# Altium project PCB_Project.PrjPcb
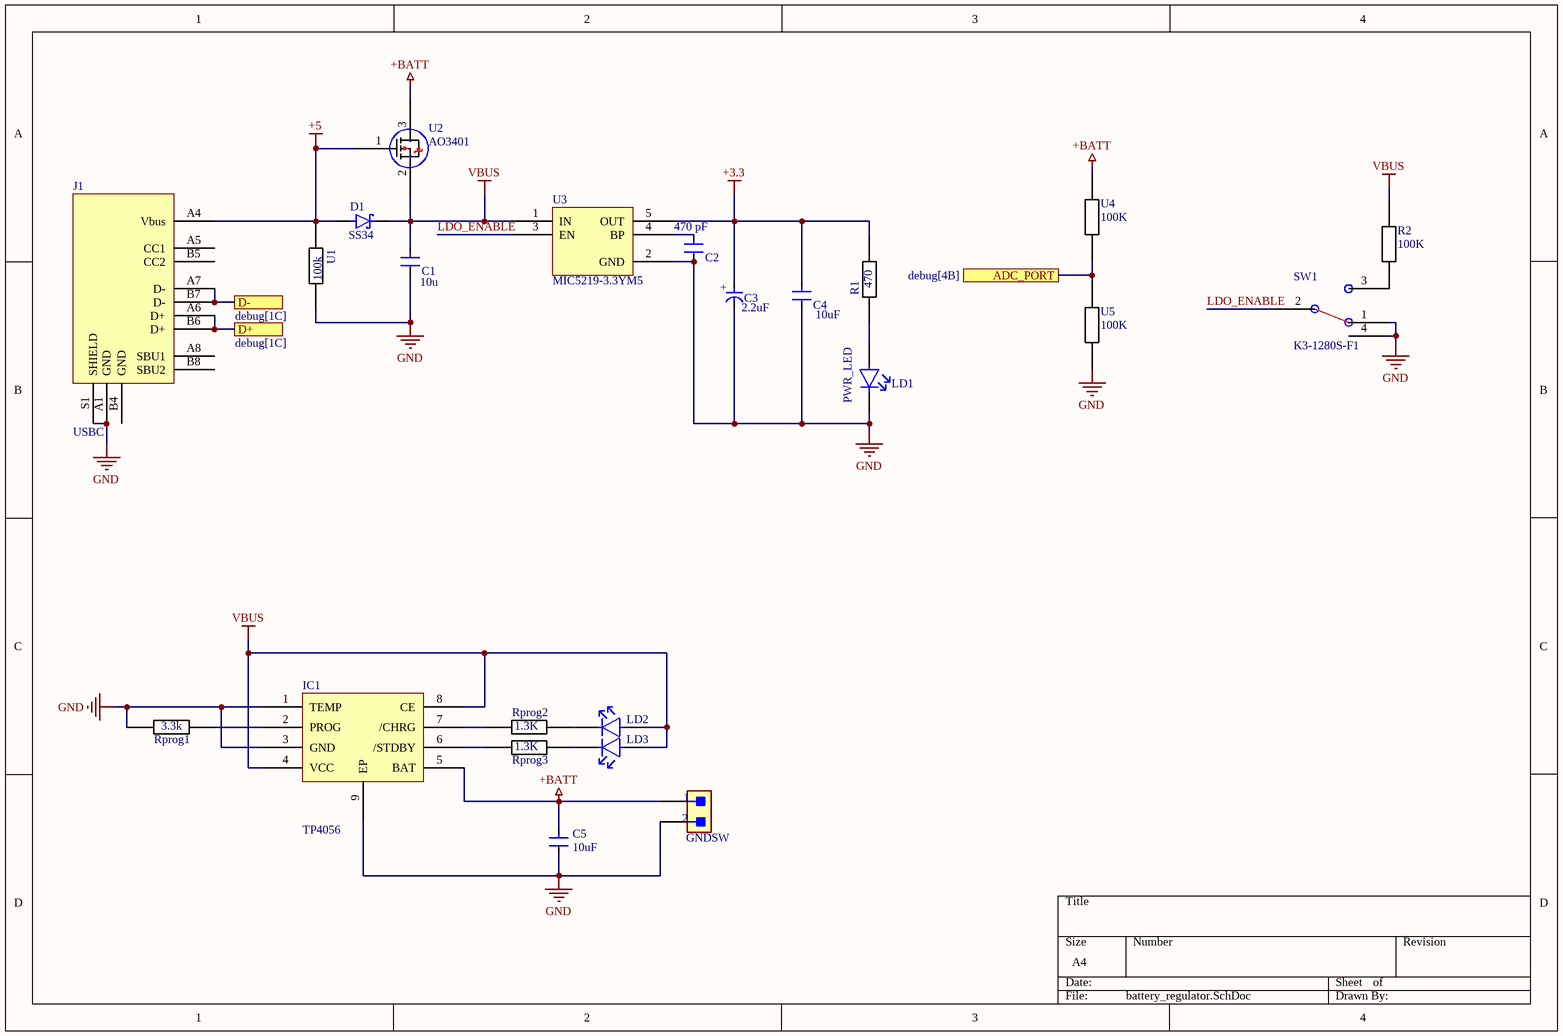
[diagram p0: battery_regulator.SchDoc]
3 sheets, 74 parts. Net scope: flat (ports and power ports of the same name join across sheets).
Board file: PCB_drone.PcbDoc
Sheets:
  battery_regulator.SchDoc
  debug.SchDoc
  motor_drivers.SchDoc

## Sheet battery_regulator.SchDoc
size A4; SheetNumber: 1; SheetTotal: 3

### Parts
C1  10u  [res0805ph]
C2  470 pF  [res0805ph]
C3  2.2uF  [res0805ph]
C4  10uF  [res0805ph]
C5  10uF  [res0805ph]
D1  SS34  [DIOM7959X265N]
GNDSW  TMM-102-02-L-S  [JST_B2B-XH-A_(LF)(SN)]  (value not drawn)
IC1  TP4056  [SOP127P600X175-9N]
J1  USBC  [SHENZHEN-CHUANGQIN-TECHNOLOGY_CQ-USB-C16PSMT01]
LD1  PWR_LED  [res0805ph]
LD2  APT1608ZGCK  [res0805ph]  (value not drawn)
LD3  APT1608ZGCK  [res0805ph]  (value not drawn)
R1  470  [res0805ph]
R2  100K  [res0805ph]
Rprog1  3.3k  [res0805ph]
Rprog2  1.3K  [res0805ph]
Rprog3  1.3K  [res0805ph]
SW1  K3-1280S-F1  [SW-SMD_K3-1280S-K1]
U1  100k  [res0805ph]
U2  AO3401  [SOT23-3]
U3  MIC5219-3.3YM5  [FP-SOT23-5LD-PL-1-IPC_C]
U4  100K  [res0805ph]
U5  100K  [res0805ph]

### Ports
ADC_PORT (see debug[4B]), D+ (see debug[1C]), D- (see debug[1C])

### Nets
+3.3: C3.2(A) C4.1 R1.2 U3.5(OUT)
+5: D1.A J1.A4(Vbus) U1.2 U2.1
+BATT: C5.1 GNDSW.1 IC1.5(BAT) U2.3 U4.1
GND: C1.2 C2.2 C3.1(C) C4.2 C5.2 GNDSW.2 IC1.1(TEMP) IC1.3(GND) IC1.9(EP) J1.A1(GND) J1.S1(SHIELD) LD1.1(C) Rprog1.2 SW1.1 SW1.4 U1.1 U3.2(GND) U5.2
VBUS: C1.1 D1.C(K) IC1.4(VCC) IC1.8(CE) LD2.2(A) LD3.2(A) R2.1 U2.2 U3.1(IN)
LDO_ENABLE: SW1.2 U3.3(EN)
NetC2_1: C2.1 U3.4(BP)
NetIC1_2: IC1.2(PROG) Rprog1.1
NetIC1_6: IC1.6(/STDBY) Rprog3.2
NetIC1_7: IC1.7(/CHRG) Rprog2.2
NetJ1_A6: J1.A6(D+) J1.B6(D+) ; port D+
NetJ1_A7: J1.A7(D-) J1.B7(D-) ; port D-
NetLD1_2: LD1.2(A) R1.1
NetLD2_1: LD2.1(C) Rprog2.1
NetLD3_1: LD3.1(C) Rprog3.1
NetR2_2: R2.2 SW1.3
NetU4_2: U4.2 U5.1 ; port ADC_PORT

Not connected (* = marked no-connect by the designer): J1 A5(CC1) A8(SBU1) B4(GND) B5(CC2) B8(SBU2)

### Notes on the sheet
- (in symbol Elco+tantaal_1) +

### Library data of the parts
C1 C2 = CER Capacitor_1: Voltage Rating (DC): 35V; Tolerance: 20%; Capacitance: 10uF; Dielectric: X6S; Width: 0.049inch; Thickness: 0.057inch; Voltage Rating: 35V; Min Operating Temperature: -55°C; Case Code (Imperial): 0805; Mount: Surface Mount; Packaging: Tape and Reel; Case/Package: 0805; Max Operating Temperature: 105°C; Length: 0.079inch; Case Code (Metric): 2012
C3 = Elco+tantaal_1: 47uF 6.3V  ±20% 1.1Ω 2917  SMD Tantalum Capacitor; ESR (Equivalent Series Resistance): 1.1R; Dissipation Factor: 6%; Polarity: Polar; Voltage Rating: 6.3V; Width: 0.169inch; Tolerance: 20%; Series: TAJ; Case/Package: 2917; Max Operating Temperature: 125°C; Depth: 4.3mm; Voltage Rating (DC): 6.3V; Package Quantity: 500; Lead Free: Lead Free; Mount: Surface Mount; Length: 0.287inch; Min Operating Temperature: -55°C; Features: General Purpose; Packaging: Tape and Reel; Capacitance: 47uF; Height - Seated (Max): 0.122inch; RoHS Compliant: Yes
C4 C5 = CER Capacitor_1: Voltage Rating (DC): 35V; Tolerance: 20%; Dielectric: X6S; Width: 0.049inch; Thickness: 0.057inch; Voltage Rating: 35V; Min Operating Temperature: -55°C; Case Code (Imperial): 0805; Mount: Surface Mount; Packaging: Tape and Reel; Capacitance: 10uF; Case/Package: 0805; Max Operating Temperature: 105°C; Length: 0.079inch; Case Code (Metric): 2012
GNDSW = Connector 1x2_1: CONN HEADER VERT 2POS 2MM; Max Voltage Rating (AC): 500V; Number of Contacts: 2; Max Current Rating: 3.9A; Gender: Male; Number of Rows: 1; REACH SVHC: No SVHC; Contact Material: Bronze; Length: 4mm; Depth: 1.97mm; Pitch: 2mm; Radiation Hardening: No; Contact Plating: Gold; Min Operating Temperature: -55°C; RoHS Compliant: Yes; Packaging: Bulk; Orientation: Straight; Housing Material: Polymer; Housing Color: Black; Max Operating Temperature: 125°C; Termination: Solder; Lead Free: Lead Free
LD1-LD3 = LED_1: LED GREEN CLEAR CHIP SMD; Forward Voltage: 3.3V; Dominant Wavelength: 525nm; Forward Current: 20mA; Lens Color: Colorless; Viewing Angle: 120°; Luminous Intensity: 350mcd; Lens Transparency: Clear; Color: Green; Max Operating Temperature: 85°C; Case/Package: 0603; Mount: Surface Mount; Min Operating Temperature: -40°C; Case Code (Metric): 1608; Test Current: 20mA; Packaging: Tape and Reel; Width: 0.8mm; Package Quantity: 1; Height: 0.75mm; Length: 1.6mm; Illumination Color: Green; Lead Free: Lead Free; Case Code (Imperial): 0603
R1 R2 Rprog1-Rprog3 U1 U4 U5 = Weerstand_1: RES SMD 5.9K OHM 1% 1/4W 1206; Manufacturer: Yageo; Manufacturer Part Number: AC1206FR-075K9L; Resistance: 5.9KΩ; Power Rating: 0.25W; Voltage Rating: 200V; Automotive Grade: Grade 0; Value: 5.9KΩ; Tolerance: 0.01; Series: AC; Mouser Description: Thick Film Resistors - SMD 1/4W 5.9ohm 1% AEC-Q200; Lead Free: Yes; Octopart: https://octopart.com/ac1206fr-075k9l-yageo-30511161; Automotive: Yes; Temperature Range High: +155°C; ComponentLink2Description: Datasheet; Ipc Land Pattern Name: RESC310160X55; Temperature Range Low: -55°C; Digikey Description: RES SMD 5.9K OHM 1% 1/4W 1206; Device Class L3: Chip SMD Resistors; Device Class L2: Resistors; Category: Res; RoHS: TRUE; Height: 0.65mm; Package: AC1206; Temperature: -55°C to +155°C; ComponentLink2URL: http://www.yageo.com/NewPortal/yageodocoutput?fileName=/pdf/R-Chip/PYu-AC_51_RoHS_L_6.pdf; Device Class L1: Passive Components; Footprint Url: http://www.yageo.com/exep/pages/download/literatures/PYu-R_Mount_10.pdf; Composition: Thick Film
SW1 = Switch
U2 = Transistor

## Sheet debug.SchDoc
size A4; SheetNumber: 2; SheetTotal: 3
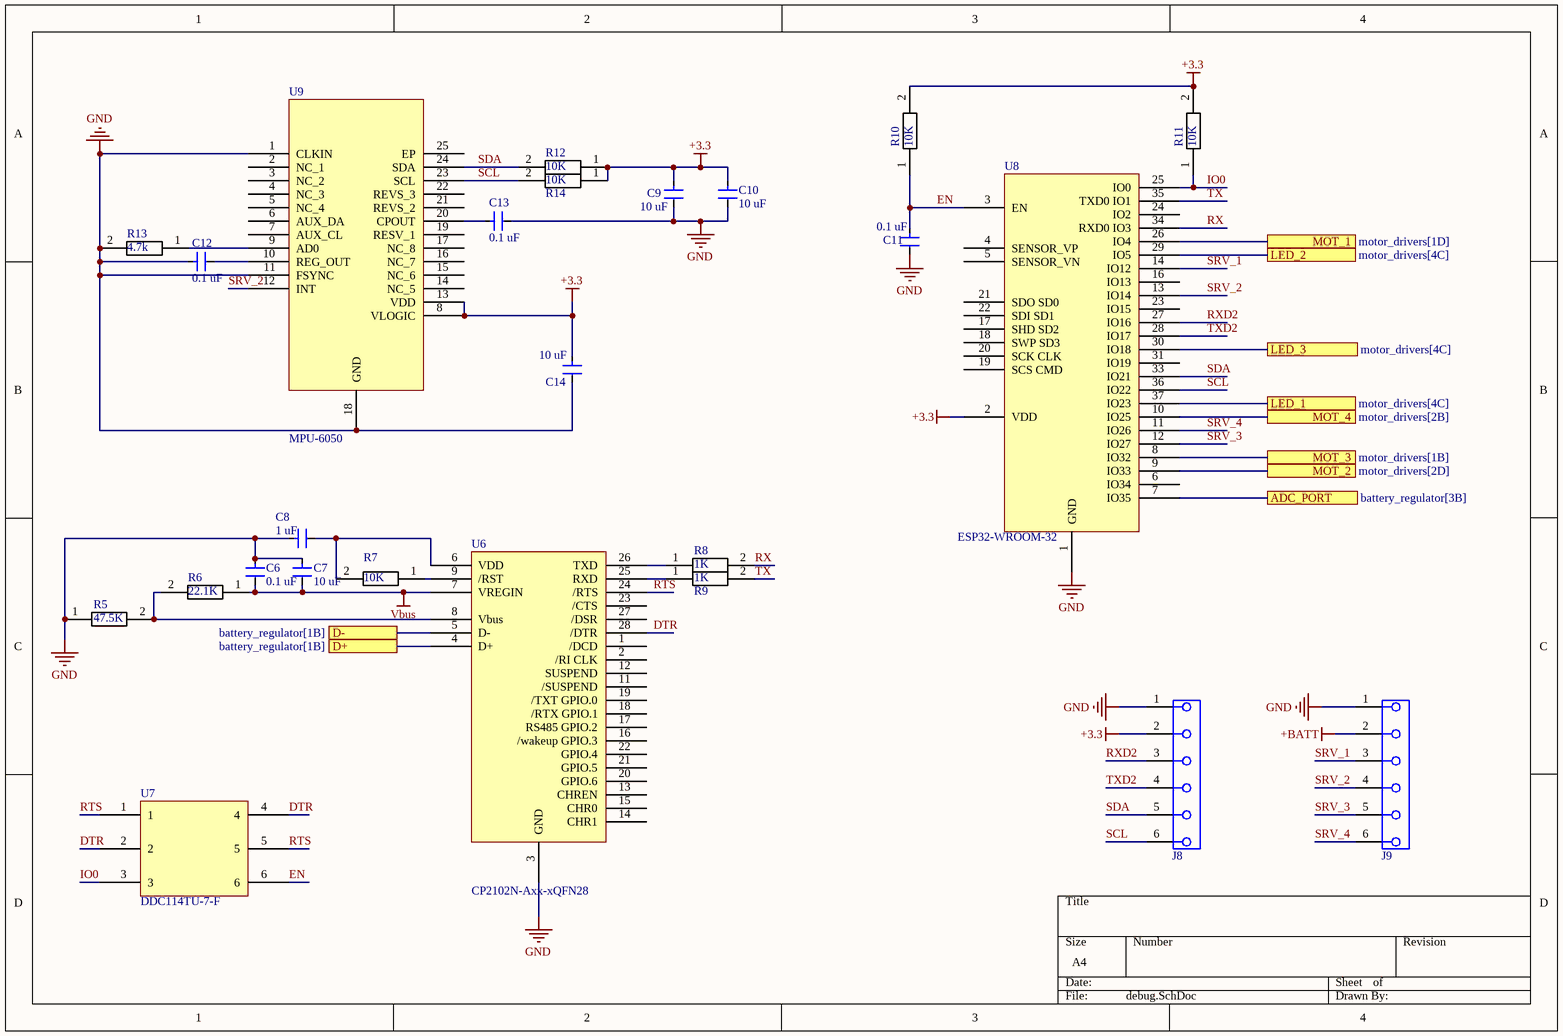
[diagram p1: debug.SchDoc]

### Parts
C6  0.1 uF  [res0805ph]
C7  10 uF  [res0805ph]
C8  1 uF  [res0805ph]
C9  10 uF  [res0805ph]
C10  10 uF  [res0805ph]
C11  0.1 uF  [res0805ph]
C12  0.1 uF  [res0805ph]
C13  0.1 uF  [res0805ph]
C14  10 uF  [res0805ph]
J8  SSW-106-02-T-S-RA  [61300611121]  (value not drawn)
J9  SSW-106-02-T-S-RA  [61300611121]  (value not drawn)
R5  47.5K  [res0805ph]
R6  22.1K  [res0805ph]
R7  10K  [res0805ph]
R8  1K  [res0805ph]
R9  1K  [res0805ph]
R10  10K  [res0805ph]
R11  10K  [res0805ph]
R12  10K  [res0805ph]
R13  4.7k  [res0805ph]
R14  10K  [res0805ph]
U6  CP2102N-Axx-xQFN28  [QFN50P500X500X80-29N]
U7  DDC114TU-7-F  [SOT65P210X110-6N]
U8  ESP32-WROOM-32  [ESP32-WROOM-32D]
U9  MPU-6050  [IS-QFN-24_V]

### Ports
ADC_PORT (see battery_regulator[3B]), D+ (see battery_regulator[1B]), D- (see battery_regulator[1B]), LED_1 (see motor_drivers[4C]), LED_2 (see motor_drivers[4C]), LED_3 (see motor_drivers[4C]), MOT_1 (see motor_drivers[1D]), MOT_2 (see motor_drivers[2D]), MOT_3 (see motor_drivers[1B]), MOT_4 (see motor_drivers[2B])

### Nets
+3.3: C9.1 C10.1 C14.1 J8.2 R10.2 R11.2 R12.1 R14.1 U8.2(VDD) U9.8(VLOGIC) U9.13(VDD)
+BATT: J9.2
GND: C6.1 C7.1 C8.1 C9.2 C10.2 C11.2 C12.1 C13.2 C14.2 J8.1 J9.1 R5.1 R13.2 U6.3(GND) U8.1(GND) U9.1(CLKIN) U9.11(FSYNC) U9.18(GND)
VBUS: C6.2 C7.2 R6.1 U6.7(VREGIN)
DTR: U6.28(/DTR) U7.2 U7.4
EN: C11.1 R10.1 U7.6 U8.3(EN)
IO0: R11.1 U7.3 U8.25(IO0)
RTS: U6.24(/RTS) U7.1 U7.5
RX: R8.2 U8.34(RXD0_IO3)
RXD2: J8.3 U8.27(IO16)
SCL: J8.6 R14.2 U8.36(IO22) U9.23(SCL)
SDA: J8.5 R12.2 U8.33(IO21) U9.24(SDA)
SRV_1: J9.3 U8.14(IO12)
SRV_2: J9.4 U8.13(IO14) U9.12(INT)
SRV_3: J9.5 U8.12(IO27)
SRV_4: J9.6 U8.11(IO26)
TX: R9.2 U8.35(TXD0_IO1)
TXD2: J8.4 U8.28(IO17)
NetC8_2: C8.2 R7.2 U6.6(VDD)
NetC12_2: C12.2 U9.10(REG_OUT)
NetC13_1: C13.1 U9.20(CPOUT)
NetJ1_A6: U6.4(D+) ; port D+
NetJ1_A7: U6.5(D-) ; port D-
NetLD4_2: U8.37(IO23) ; port LED_1
NetLD5_2: U8.29(IO5) ; port LED_2
NetLD6_2: U8.30(IO18) ; port LED_3
NetR5_2: R5.2 R6.2 U6.8(Vbus)
NetR7_1: R7.1 U6.9(/RST)
NetR8_1: R8.1 U6.26(TXD)
NetR9_1: R9.1 U6.25(RXD)
NetR13_1: R13.1 U9.9(AD0)
NetR18_2: U8.26(IO4) ; port MOT_1
NetR19_2: U8.9(IO33) ; port MOT_2
NetR20_2: U8.8(IO32) ; port MOT_3
NetR21_2: U8.10(IO25) ; port MOT_4
NetU4_2: U8.7(IO35) ; port ADC_PORT

Not connected (* = marked no-connect by the designer): U6 1(/DCD) 2(/RI_CLK) 11(/SUSPEND) 12(SUSPEND) 13(CHREN) 14(CHR1) 15(CHR0) 16(/wakeup_GPIO.3) 17(RS485_GPIO.2) 18(/RTX_GPIO.1) 19(/TXT_GPIO.0) 20(GPIO.6) 21(GPIO.5) 22(GPIO.4) 23(/CTS) 27(/DSR); U8 4(SENSOR_VP) 5(SENSOR_VN) 6(IO34) 16(IO13) 17(SHD_SD2) 18(SWP_SD3) 19(SCS_CMD) 20(SCK_CLK) 21(SDO_SD0) 22(SDI_SD1) 23(IO15) 24(IO2) 31(IO19); U9 2(NC_1) 3(NC_2) 4(NC_3) 5(NC_4) 6(AUX_DA) 7(AUX_CL) 14(NC_5) 15(NC_6) 16(NC_7) 17(NC_8) 19(RESV_1) 21(REVS_2) 22(REVS_3) 25(EP)

### Library data of the parts
C6-C14 = CER Capacitor_1: as C1 on sheet battery_regulator; Width: 0.049inch; Thickness: 0.057inch; Voltage Rating: 35V; Min Operating Temperature: -55°C; Case Code (Imperial): 0805; Mount: Surface Mount; Packaging: Tape and Reel; Case/Package: 0805; Max Operating Temperature: 105°C; Length: 0.079inch; Case Code (Metric): 2012
J8 J9 = Connector 1x6_1: SQ Post Socket, Through-hole, Right Angle, -55 to 105 degC, 2.54mm Pitch, 6-Pin, Female, RoHS; Manufacturer: Samtec; DatasheetVersion: F-214; PackageReference: SSW-106-02-X-S-RA; ComponentLink1URL: http://www.samtec.com; Temperature Range: -55 to 105 degC; Orientation: Right Angle; ComponentLink2Description: Datasheet; PartNumber: SSW-106-02-T-S-RA; PackageVersion: CA, 6/1987; Pitch: 2.54 mm; Mounting Technology: Through-hole; PackageDescription: Assembly, Socket Strip .016 X .031 Tail; ComponentLink2URL: http://www.samtec.com/documents/webfiles/pdf/SSW_TH.PDF; RoHS: True; ComponentLink3URL: http://www.samtec.com/documents/webfiles/cpdf/SSW-1XX-XX-XXX-X-XX-XXX-XX-MKT.pdf; ComponentLink1Description: Manufacturer URL; ComponentLink3Description: Package Specification
R5-R14 = Weerstand: RES SMD 5.9K OHM 1% 1/4W 1206; Manufacturer: Yageo; Manufacturer Part Number: AC1206FR-075K9L; Resistance: 5.9KΩ; Power Rating: 0.25W; Voltage Rating: 200V; Automotive Grade: Grade 0; Value: 5.9KΩ; Tolerance: 0.01; Series: AC; Mouser Description: Thick Film Resistors - SMD 1/4W 5.9ohm 1% AEC-Q200; Lead Free: Yes; Octopart: https://octopart.com/ac1206fr-075k9l-yageo-30511161; Automotive: Yes; Temperature Range High: +155°C; ComponentLink2Description: Datasheet; Ipc Land Pattern Name: RESC310160X55; Temperature Range Low: -55°C; Digikey Description: RES SMD 5.9K OHM 1% 1/4W 1206; Device Class L3: Chip SMD Resistors; Device Class L2: Resistors; Category: Res; RoHS: TRUE; Height: 0.65mm; Package: AC1206; Temperature: -55°C to +155°C; ComponentLink2URL: http://www.yageo.com/NewPortal/yageodocoutput?fileName=/pdf/R-Chip/PYu-AC_51_RoHS_L_6.pdf; Device Class L1: Passive Components; Footprint Url: http://www.yageo.com/exep/pages/download/literatures/PYu-R_Mount_10.pdf; Composition: Thick Film

## Sheet motor_drivers.SchDoc
size A4; SheetNumber: 3; SheetTotal: 3
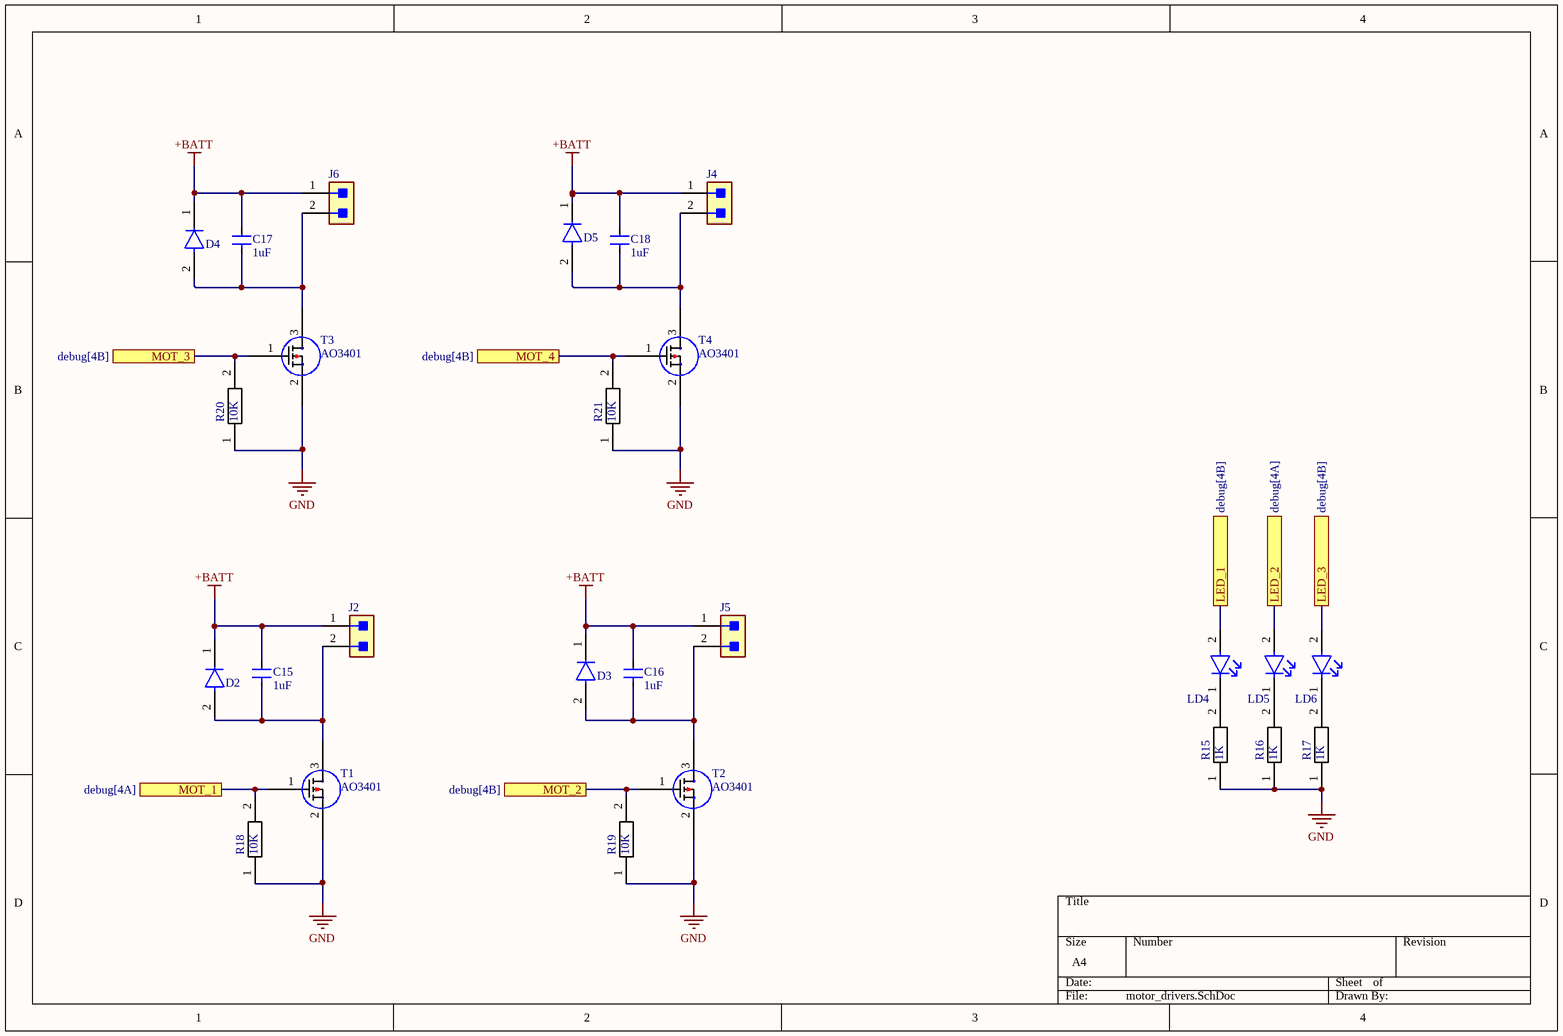
[diagram p2: motor_drivers.SchDoc]

### Parts
C15  1uF  [res0805ph]
C16  1uF  [res0805ph]
C17  1uF  [res0805ph]
C18  1uF  [res0805ph]
D2  APT1608ZGCK  [SOD3715X135N]  (value not drawn)
D3  APT1608ZGCK  [SOD3715X135N]  (value not drawn)
D4  APT1608ZGCK  [SOD3715X135N]  (value not drawn)
D5  APT1608ZGCK  [SOD3715X135N]  (value not drawn)
J2  TMM-102-02-L-S  [JST_B2B-XH-A_(LF)(SN)]  (value not drawn)
J4  TMM-102-02-L-S  [JST_B2B-XH-A_(LF)(SN)]  (value not drawn)
J5  TMM-102-02-L-S  [JST_B2B-XH-A_(LF)(SN)]  (value not drawn)
J6  TMM-102-02-L-S  [JST_B2B-XH-A_(LF)(SN)]  (value not drawn)
LD4  APT1608ZGCK  [res0805ph]  (value not drawn)
LD5  APT1608ZGCK  [res0805ph]  (value not drawn)
LD6  APT1608ZGCK  [res0805ph]  (value not drawn)
R15  1K  [res0805ph]
R16  1K  [res0805ph]
R17  1K  [res0805ph]
R18  10K  [res0805ph]
R19  10K  [res0805ph]
R20  10K  [res0805ph]
R21  10K  [res0805ph]
T1  AO3401  [NXP-SOT23_N]
T2  AO3401  [NXP-SOT23_N]
T3  AO3401  [NXP-SOT23_N]
T4  AO3401  [NXP-SOT23_N]

### Ports
LED_1 (see debug[4B]), LED_2 (see debug[4A]), LED_3 (see debug[4B]), MOT_1 (see debug[4A]), MOT_2 (see debug[4B]), MOT_3 (see debug[4B]), MOT_4 (see debug[4B])

### Nets
+BATT: C15.2 C16.2 C17.2 C18.2 D2.1(C) D3.1(C) D4.1(C) D5.1(C) J2.1 J4.1 J5.1 J6.1
GND: R15.1 R16.1 R17.1 R18.1 R19.1 R20.1 R21.1 T1.2 T2.2 T3.2 T4.2
NetC15_1: C15.1 D2.2(A) J2.2 T1.3
NetC16_1: C16.1 D3.2(A) J5.2 T2.3
NetC17_1: C17.1 D4.2(A) J6.2 T3.3
NetC18_1: C18.1 D5.2(A) J4.2 T4.3
NetLD4_1: LD4.1(C) R15.2
NetLD4_2: LD4.2(A) ; port LED_1
NetLD5_1: LD5.1(C) R16.2
NetLD5_2: LD5.2(A) ; port LED_2
NetLD6_1: LD6.1(C) R17.2
NetLD6_2: LD6.2(A) ; port LED_3
NetR18_2: R18.2 T1.1 ; port MOT_1
NetR19_2: R19.2 T2.1 ; port MOT_2
NetR20_2: R20.2 T3.1 ; port MOT_3
NetR21_2: R21.2 T4.1 ; port MOT_4

### Library data of the parts
C15-C18 = CER Capacitor_1: as C1 on sheet battery_regulator; Width: 0.049inch; Thickness: 0.057inch; Voltage Rating: 35V; Min Operating Temperature: -55°C; Case Code (Imperial): 0805; Mount: Surface Mount; Packaging: Tape and Reel; Case/Package: 0805; Max Operating Temperature: 105°C; Length: 0.079inch; Case Code (Metric): 2012
D2-D5 = 1N4148W: Diode; Forward Voltage: 3.3V; Lens Transparency: Clear; Color: Green; Dominant Wavelength: 525nm; Forward Current: 20mA; Lens Color: Colorless; Viewing Angle: 120°; Luminous Intensity: 350mcd; Max Operating Temperature: 85°C; Case/Package: 0603; Mount: Surface Mount; Min Operating Temperature: -40°C; Case Code (Metric): 1608; Test Current: 20mA; Packaging: Tape and Reel; Width: 0.8mm; Package Quantity: 1; Height: 0.75mm; Length: 1.6mm; Illumination Color: Green; Lead Free: Lead Free; Case Code (Imperial): 0603
J2 J4-J6 = Connector 1x2: CONN HEADER VERT 2POS 2MM; Max Voltage Rating (AC): 500V; Number of Contacts: 2; Max Current Rating: 3.9A; Gender: Male; Number of Rows: 1; REACH SVHC: No SVHC; Contact Material: Bronze; Length: 4mm; Depth: 1.97mm; Pitch: 2mm; Radiation Hardening: No; Contact Plating: Gold; Min Operating Temperature: -55°C; RoHS Compliant: Yes; Packaging: Bulk; Orientation: Straight; Housing Material: Polymer; Housing Color: Black; Max Operating Temperature: 125°C; Termination: Solder; Lead Free: Lead Free
LD4-LD6 = LED: LED GREEN CLEAR CHIP SMD; Forward Voltage: 3.3V; Dominant Wavelength: 525nm; Forward Current: 20mA; Lens Color: Colorless; Viewing Angle: 120°; Luminous Intensity: 350mcd; Lens Transparency: Clear; Color: Green; Max Operating Temperature: 85°C; Case/Package: 0603; Mount: Surface Mount; Min Operating Temperature: -40°C; Case Code (Metric): 1608; Test Current: 20mA; Packaging: Tape and Reel; Width: 0.8mm; Package Quantity: 1; Height: 0.75mm; Length: 1.6mm; Illumination Color: Green; Lead Free: Lead Free; Case Code (Imperial): 0603
R15-R21 = Weerstand: as R5 on sheet debug; Series: AC; Mouser Description: Thick Film Resistors - SMD 1/4W 5.9ohm 1% AEC-Q200; Lead Free: Yes; Octopart: https://octopart.com/ac1206fr-075k9l-yageo-30511161; Automotive: Yes; Temperature Range High: +155°C; ComponentLink2Description: Datasheet; Ipc Land Pattern Name: RESC310160X55; Temperature Range Low: -55°C; Digikey Description: RES SMD 5.9K OHM 1% 1/4W 1206; Device Class L3: Chip SMD Resistors; Device Class L2: Resistors; Category: Res; RoHS: TRUE; Height: 0.65mm; Package: AC1206; Temperature: -55°C to +155°C; ComponentLink2URL: http://www.yageo.com/NewPortal/yageodocoutput?fileName=/pdf/R-Chip/PYu-AC_51_RoHS_L_6.pdf; Device Class L1: Passive Components; Footprint Url: http://www.yageo.com/exep/pages/download/literatures/PYu-R_Mount_10.pdf; Composition: Thick Film
T1-T4 = SI2302DS-T1

## Nets that join several sheets
+3.3: battery_regulator (C3.2 C4.1 R1.2 U3.5), debug (11 pins)
+BATT: battery_regulator (5 pins), debug (J9.2), motor_drivers (12 pins)
GND: battery_regulator (18 pins), debug (18 pins), motor_drivers (11 pins)
VBUS: battery_regulator (9 pins), debug (C6.2 C7.2 R6.1 U6.7)
NetJ1_A6: battery_regulator (J1.A6 J1.B6), debug (U6.4)
NetJ1_A7: battery_regulator (J1.A7 J1.B7), debug (U6.5)
NetLD4_2: debug (U8.37), motor_drivers (LD4.2)
NetLD5_2: debug (U8.29), motor_drivers (LD5.2)
NetLD6_2: debug (U8.30), motor_drivers (LD6.2)
NetR18_2: debug (U8.26), motor_drivers (R18.2 T1.1)
NetR19_2: debug (U8.9), motor_drivers (R19.2 T2.1)
NetR20_2: debug (U8.8), motor_drivers (R20.2 T3.1)
NetR21_2: debug (U8.10), motor_drivers (R21.2 T4.1)
NetU4_2: battery_regulator (U4.2 U5.1), debug (U8.7)